# EAGLE schematic EAA690_RFID_Outside (EAGLE 7.3.0)
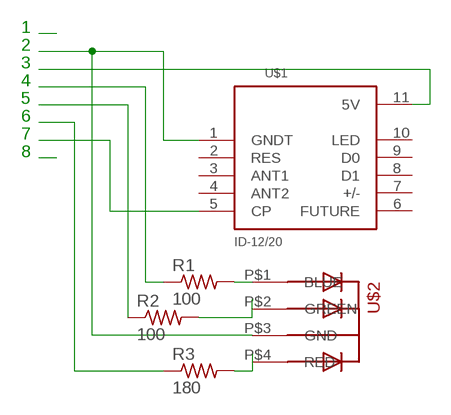
[diagram p0: schematic, sheet 1]

## Parts
R1  100  R-US_0204/5  [0204/5]
R2  100  R-US_0204/5  [0204/5]
R3  180  R-US_0204/5  [0204/5]
U$1  ID-12/20  [ID-12]
U$2  5MMRGBLED  [LED5MMRGB]

## Nets
N$2: U$1.1(GNDT) U$2.P$3(GND)
N$3: U$1.11(5V)
N$4: R1.2 U$2.P$1(BLUE)
N$5: R3.2
N$6: R2.2
N$8: R1.1
N$9: R2.1
N$10: R3.1
N$11: U$1.5(CP)
Unconnected: U$1.2(RES) U$1.3(ANT1) U$1.4(ANT2) U$1.6(FUTURE) U$1.7(+/-) U$1.8(D1) U$1.9(D0) U$1.10(LED) U$2.P$2(GREEN) U$2.P$4(RED)

## Notes on the sheet
- 1
- 2
- 3
- 4
- 5
- 6
- 7
- 8

## Library data of the parts
R1-R3 = resistor:R-US_: RESISTOR, American symbol
U$1 = SparkFun-RF:ID-12/20: RFID reader for ID2, ID12, and ID20 Package
U$2 = led_rgb:5MMRGBLED